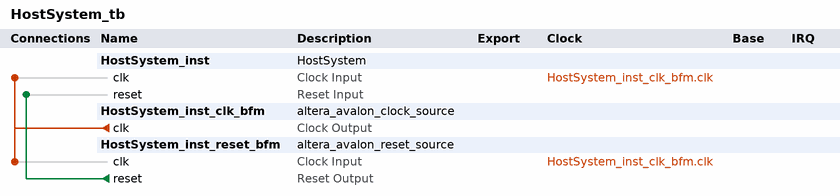
[diagram p0: system contents]
# Platform Designer (Qsys) system HostSystem_tb, Cyclone II EP2C35F672C6
# Parameters at their usual value, and those the tool derives, are not listed.
package require -exact qsys 13.0
create_system HostSystem_tb
set_project_property DEVICE_FAMILY {Cyclone II}
set_project_property DEVICE EP2C35F672C6

add_instance HostSystem_inst HostSystem 1.0

add_instance HostSystem_inst_clk_bfm altera_avalon_clock_source 13.0
set_instance_parameter_value HostSystem_inst_clk_bfm CLOCK_RATE 25000000

add_instance HostSystem_inst_reset_bfm altera_avalon_reset_source 13.0
set_instance_parameter_value HostSystem_inst_reset_bfm ASSERT_HIGH_RESET 0
set_instance_parameter_value HostSystem_inst_reset_bfm INITIAL_RESET_CYCLES 50

# connections
add_connection HostSystem_inst_clk_bfm.clk HostSystem_inst.clk clock
add_connection HostSystem_inst_clk_bfm.clk HostSystem_inst_reset_bfm.clk clock
add_connection HostSystem_inst_reset_bfm.reset HostSystem_inst.reset reset

set_interconnect_requirement {$system} qsys_mm.clockCrossingAdapter HANDSHAKE
set_interconnect_requirement {$system} qsys_mm.maxAdditionalLatency 1

save_system HostSystem_tb.qsys
